# EAGLE design DoubleSwitch (EAGLE 6.6.0)
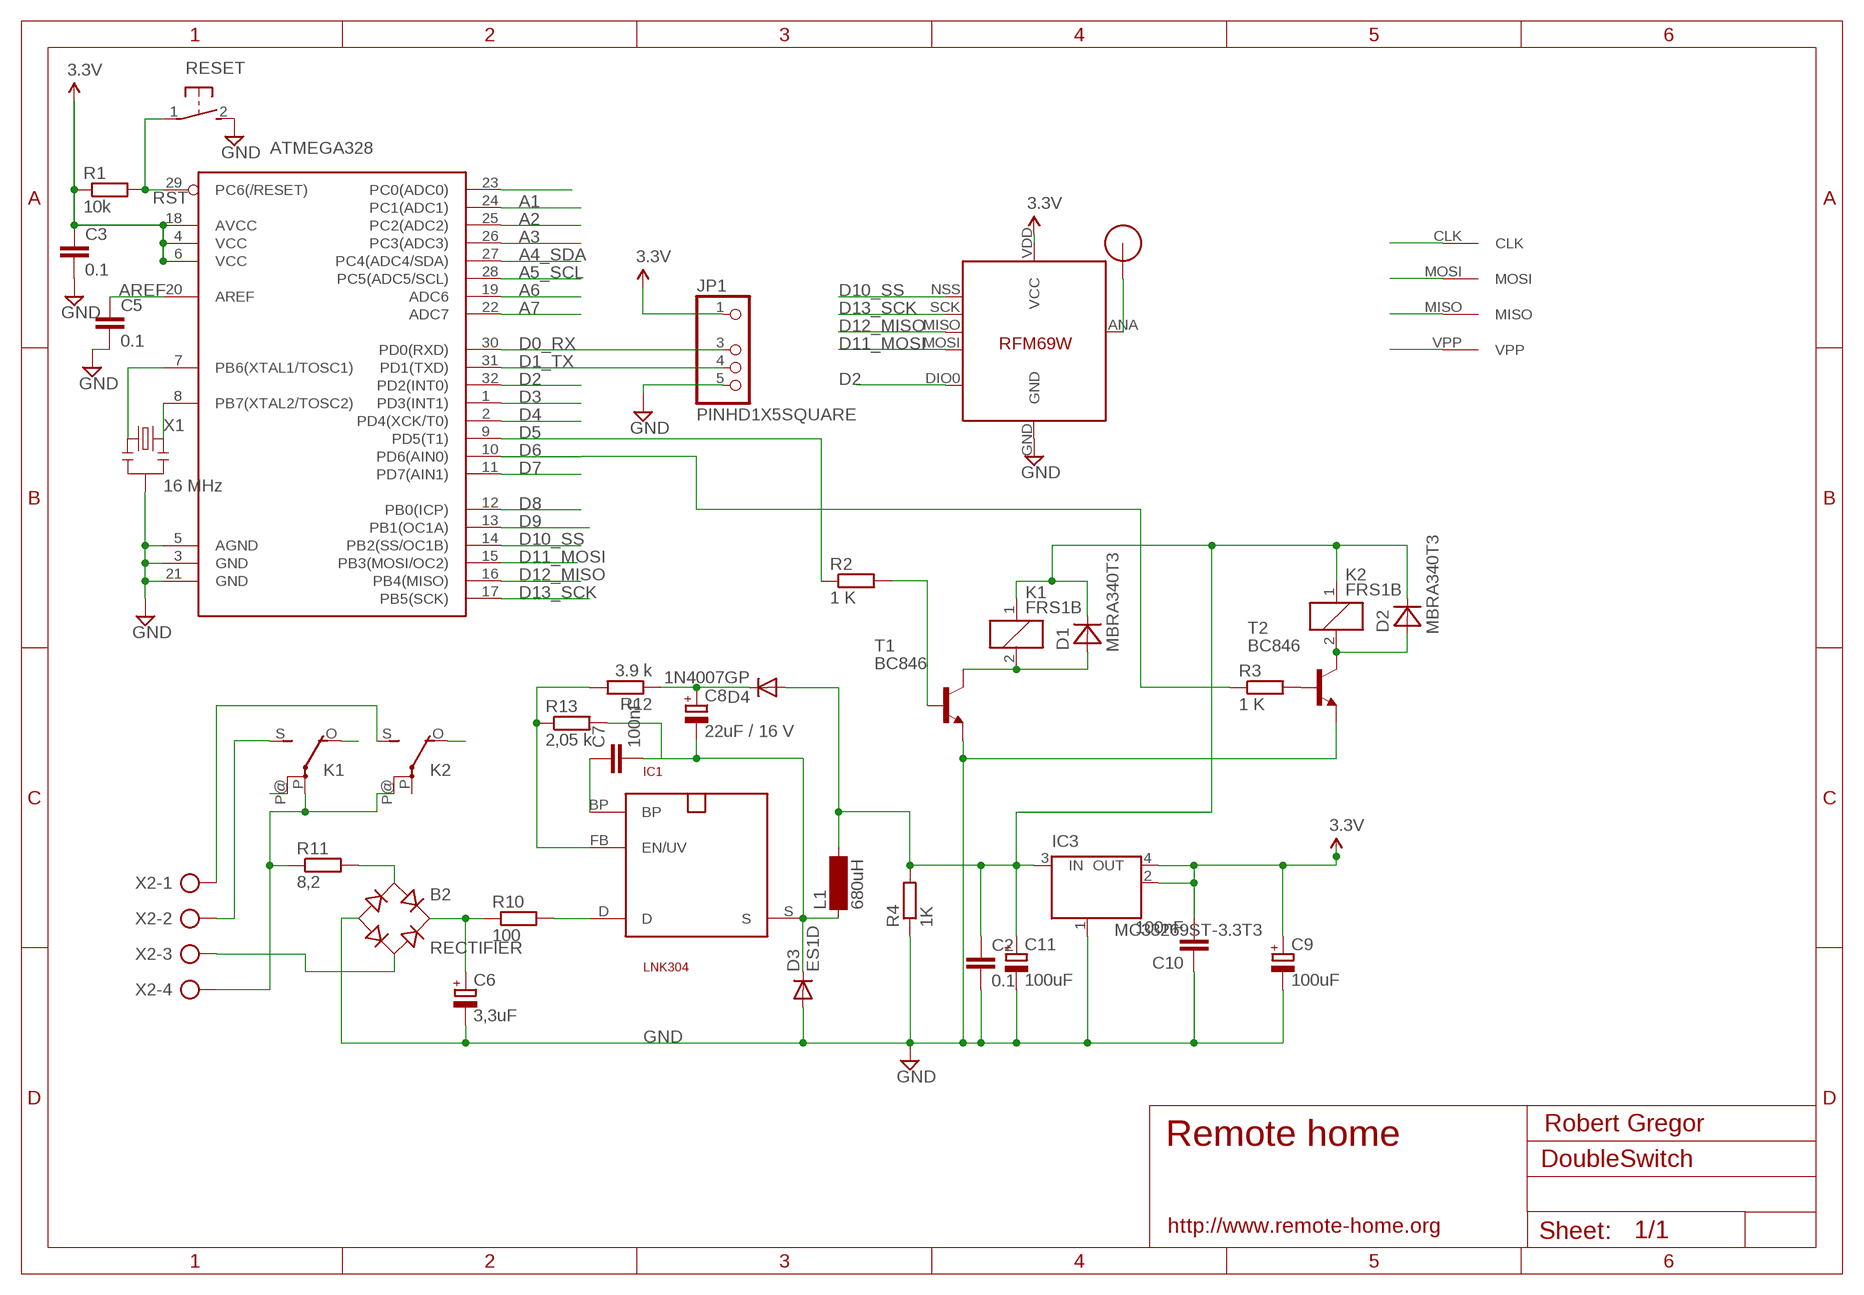
[diagram p0: schematic, sheet 1]

## Parts
ATMEGA328  ATMega-328  ATMEGA168/328TQFP32  [TQFP32-08]
B2  RECTIFIER  RECTIFIER-S40  [TO-269AA]
C2  0.1  C-EUC2012  [C2012]
C3  0.1  C-EUC2012  [C2012]
C5  0.1  C-EUC2012  [C2012]
C6  3,3uF  CPOL-EUE5-10.5  [E5-10,5]
C7  100nF  C-EUC2012  [C2012]
C8  22uF / 16 V  CPOL-EUSMCC  [SMC_C]
C9  100uF  CPOL-EUSMCB  [SMC_B]
C10  100nF  C-EUC2012  [C2012]
C11  100uF  CPOL-EUSMCB  [SMC_B]
D1  MBRA340T3  [SMA]
D2  MBRA340T3  [SMA]
D3  ES1D  DIODE-DO214AC  [DO214AC]
D4  1N4007GP  DIODE-DO214AA  [DO214AA]
IC1  LNK304  SO-8C  [SO-8C]
IC3  MC33269ST-3.3T3  [SOT223]
JP1  PINHD1X5SQUARE  [PINHD1X05-SQUARE]
K1  FRS1B  [FRS1B]
K2  FRS1B  [FRS1B]
L1  680uH  BS11  [BS11]
R1  10k  R-EU_M2012  [M2012]
R2  1 K  R-EU_M2012  [M2012]
R3  1 K  R-EU_M2012  [M2012]
R4  1K  R-EU_M2012  [M2012]
R10  100  R-EU_R2512W  [R2512W]
R11  8,2  R-EU_0411/12  [0411/12]
R12  3.9 k  R-EU_M2012  [M2012]
R13  2,05 k  R-EU_M2012  [M2012]
RESET  DTSM-3  [DTSM-3]
T1  BC846  [SOT23]
T2  BC846  [SOT23]
U$1  RFM12B_ANTENNA  [RFM12B-ANTENNA]
U$2  AVRHEADERDIP  [AVRHEADER]
U$5  RFM69  [RFM69W-MINPADS]
X1  16 MHz  RESONATORSMD  [RESONATOR-SMD]
X2  AK500/4  [AK500/4]

## Nets
5V: C2.1 C11.+ D1.C D2.C D4.A IC3.3(IN) K1.1 K2.1 L1.2 R4.2
A0: ATMEGA328.23(PC0(ADC0))
A1: ATMEGA328.24(PC1(ADC1))
A2: ATMEGA328.25(PC2(ADC2))
A3: ATMEGA328.26(PC3(ADC3))
A4_SDA: ATMEGA328.27(PC4(ADC4/SDA))
A5_SCL: ATMEGA328.28(PC5(ADC5/SCL))
A6: ATMEGA328.19(ADC6)
A7: ATMEGA328.22(ADC7)
AREF: ATMEGA328.20(AREF) C5.1
D0_RX: ATMEGA328.30(PD0(RXD)) JP1.3
D1_TX: ATMEGA328.31(PD1(TXD)) JP1.4
D2: ATMEGA328.32(PD2(INT0)) U$5.DIO0
D3: ATMEGA328.1(PD3(INT1))
D4: ATMEGA328.2(PD4(XCK/T0))
D5: ATMEGA328.9(PD5(T1)) R2.1
D6: ATMEGA328.10(PD6(AIN0)) R3.1
D7: ATMEGA328.11(PD7(AIN1))
D8: ATMEGA328.12(PB0(ICP))
D9: ATMEGA328.13(PB1(OC1A))
D10_SS: ATMEGA328.14(PB2(SS/OC1B)) U$5.NSS(SEL)
D11_MOSI: ATMEGA328.15(PB3(MOSI/OC2)) U$2.MOSI U$5.MOSI
D12_MISO: ATMEGA328.16(PB4(MISO)) U$2.MISO U$5.MISO
D13_SCK: ATMEGA328.17(PB5(SCK)) U$2.CLK U$5.SCK
GND [power]: ATMEGA328.3(GND) ATMEGA328.5(AGND) ATMEGA328.21(GND) B2.- C2.2 C3.2 C5.2 C6.- C9.- C10.1 C11.- D3.A IC3.1(GND/ADJ) JP1.5 R4.1 RESET.2 T1.2(E) T2.2(E) U$5.GND X1.2
N678: IC1.FB(EN/UV) R12.2 R13.1
N$1: ATMEGA328.7(PB6(XTAL1/TOSC1)) X1.1
N$2: R2.2 T1.1(B)
N$3: U$1.P$1 U$5.ANA(ANT)
N$4: D2.A K2.2 T2.3(C)
N$5: D1.A K1.2 T1.3(C)
N$6: R3.2 T2.1(B)
N$7 [220V]: K1.S(2:S) X2.2
N$9 [220V]: B2.AC2 X2.3
N$11 [220V]: K1.P@(2:P)
N$12 [220V]: K2.S(2:S) X2.1
N$13 [220V]: IC1.D R10.2
N$14 [220V]: B2.+ C6.+ R10.1
N$15 [220V]: B2.AC1 R11.2
N$16 [220V]: K1.P(2:P) K2.P@(2:P) R11.1 X2.4
N$17 [220V]: K1.O(2:O)
N$18: C7.1 IC1.BP
N$19 [220V]: K2.O(2:O)
N$20: C8.+ D4.C R12.1
N$21: ATMEGA328.8(PB7(XTAL2/TOSC2)) X1.3
RST: ATMEGA328.29(PC6(/RESET)) R1.2 RESET.1 U$2.VPP
S: C7.2 C8.- D3.C IC1.S L1.1 R13.2
VCC: ATMEGA328.4(VCC) ATMEGA328.6(VCC) ATMEGA328.18(AVCC) C3.1 C9.+ C10.2 IC3.2(OUT) IC3.4(OUT) JP1.1 R1.1 U$5.VDD(VCC) ; supply symbol labelled 3.3V
Unconnected: K2.P(2:P)

## Notes on the sheet
- Robert Gregor
- Remote home
- http://www.remote-home.org

## Library data of the parts
ATMEGA328 = LowPowerLab:ATMEGA168/328: Atmel 32-pin 8-bit micro, 16k flash.
B2 = rectifier:RECTIFIER-: Rectifier
C2 C3 C5 C7 C10 = resistor:C-EU: CAPACITOR, European symbol
C6 C8 C9 C11 = resistor:CPOL-EU: POLARIZED CAPACITOR, European symbol
D1 D2 = diode:MBRA340T3: Surface Mount Schottky Power Rectifier Source: http://www.onsemi.com/pub_link/Collateral/MBRA340T3-D.PDF
D3 D4 = diode:DIODE-: DIODE
IC1 = powerint:SO-8C: 700V MOSFET für Schaltnetz-Trafos. Pin 3 fehlt. SMD
IC3 = linear:MC33269ST*: Adjustable Output Low Dropout Voltage Regulator 800 mA Source: http://www.onsemi.com/pub/Collateral/MC33269-D.PDF
JP1 = eagle-library-edeca.net-v5:PINHD1X5
K1 K2 = relay:FRS1B: RELAY 1 x switch, same as V23101-D6-A201, Siemens; OC_FARNELL: unknown; OC_NEWARK: unknown
L1 = inductor-neosid:BS: INDUCTOR nominal inductance, magnetically screened; OC_FARNELL: unknown; OC_NEWARK: unknown
R1-R4 R10-R13 = resistor:R-EU_: RESISTOR, European symbol
RESET = switch-tact:DTSM-3
T1 T2 = transistor:BC846: NPN TRANSISTOR
U$1 = LowPowerLab:RFM12B_ANTENNA
U$2 = RemoteHome:AVRHEADER
U$5 = LowPowerLab:RFM69
X1 = SparkFun:RESONATOR: Resonator Small SMD resonator. This is the itty bitty 10/20MHz resonators with built in caps. CSTCE10M0G55 and CSTCE20M0V53. Footprint has been reviewed closely but hasn't been tested yet.
X2 = con-ptr500:AK500/4: CONNECTOR; OC_FARNELL: unknown; OC_NEWARK: unknown

## Net classes
1 power: width 0.381 mm, clearance 0.254 mm
2 220V: width 0.381 mm, clearance 0.508 mm

## Board
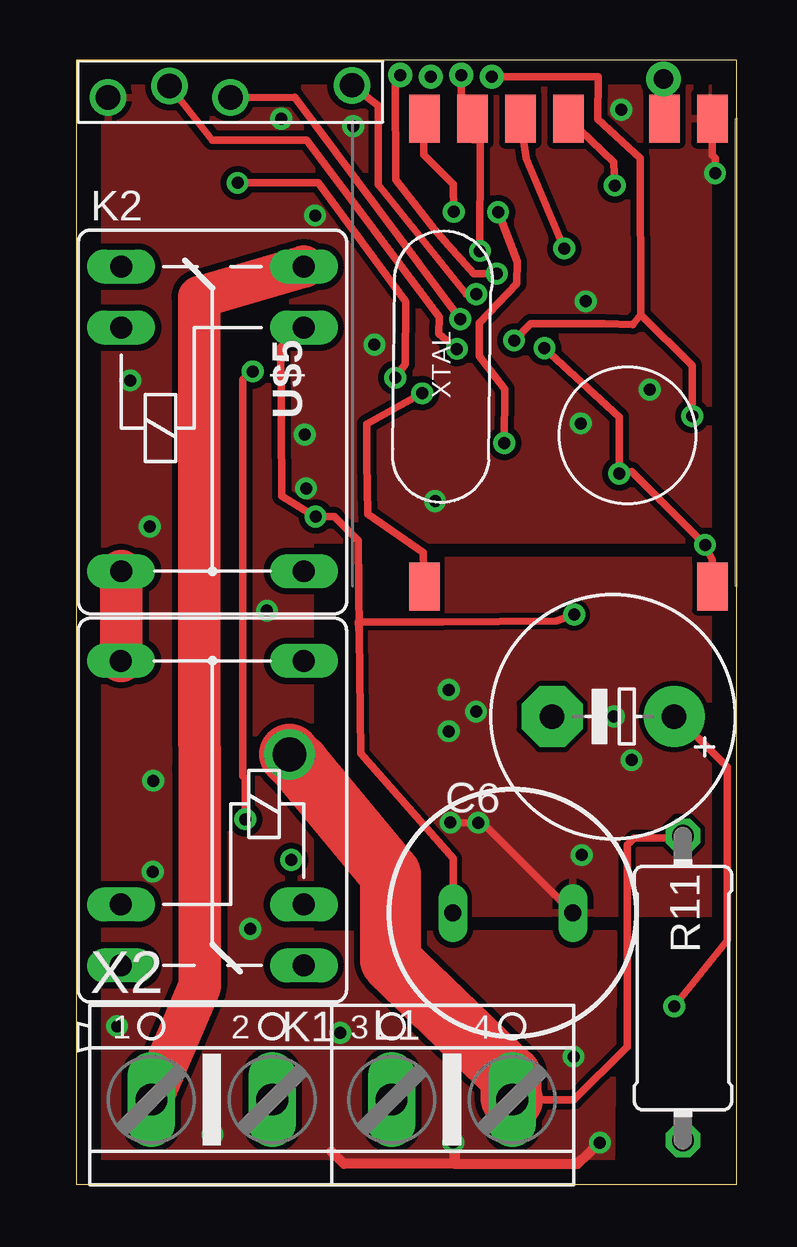
[diagram p1: board, top side]
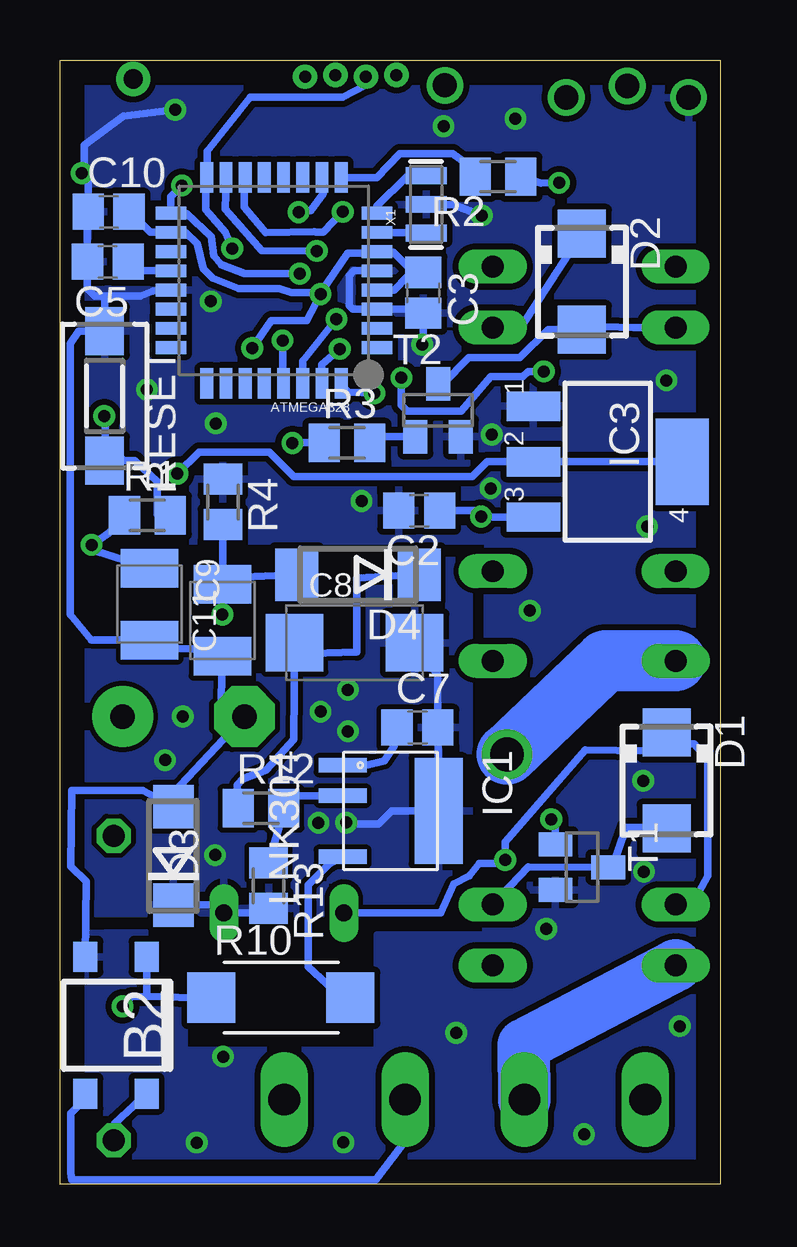
[diagram p2: board, bottom side, seen from below]

Size 27.51 x 46.86 mm. Coordinates in mm from the lower left corner, seen from the top.
Outline: 0.01,46.86 27.51,46.86 27.51,46.78 27.5,0 0,0 0,46.86
Copper layers (1*16): Top 0.035mm / dielectric 1.5mm / Bottom 0.035mm
Design rules "default": minimum track width 10mil, minimum drill 24mil, track to track 8mil, track to pad 8mil, pad to pad 8mil, via to via 8mil, smd to smd 8mil, copper to edge 40mil, drill to drill 8mil, minimum pad ring 10mil, minimum via ring 8mil, stop-mask expansion 4mil, vias tented up to drill 0mil, thermal gap 10mil

### Footprints (pad centres in the part's own frame; a part is rotated, then mirrored left to right if it is on the bottom)
TQFP32-08 = smd 1.27 x 0.533: 1 -4.293,2.8; 2 -4.293,2; 3 -4.293,1.2; 4 -4.293,0.4; 5 -4.293,-0.4; 6 -4.293,-1.2; 7 -4.293,-2; 8 -4.293,-2.8; 17 4.293,-2.8; 18 4.293,-2; 19 4.293,-1.2; 20 4.293,-0.4; 21 4.293,0.4; 22 4.293,1.2; 23 4.293,2; 24 4.293,2.8 | smd 0.533 x 1.27: 9 -2.8,-4.293; 10 -2,-4.293; 11 -1.2,-4.293; 12 -0.4,-4.293; 13 0.4,-4.293; 14 1.2,-4.293; 15 2,-4.293; 16 2.8,-4.293; 25 2.8,4.293; 26 2,4.293; 27 1.2,4.293; 28 0.4,4.293; 29 -0.4,4.293; 30 -1.2,4.293; 31 -2,4.293; 32 -2.8,4.293
TO-269AA = smd 1 x 1.25: + -1.28,-2.855; - 1.28,-2.855; AC1 -1.28,2.855; AC2 1.28,2.855
C2012 = smd 1.3 x 1.5: 1 -0.85,0; 2 0.85,0
E5-10,5 = drill 1.016 pad 2.54: + -2.54,0 | drill 1.016 pad 2.54 octagon: - 2.54,0
SMC_C = smd 2.4 x 2.4: + -2.5,0; - 2.5,0
SMC_B = smd 1.6 x 2.4: + -1.5,0; - 1.5,0
SMA = smd 2 x 2: A 2,0; C -2,0
DO214AC = smd 1.8 x 1.7: A 2.05,0; C -2.05,0
DO214AA = smd 1.8 x 2.2: A 2.55,0; C -2.55,0
SO-8C = smd 0.6 x 2: BP -1.905,-2; D 1.905,-2; FB -0.635,-2 | smd 4.41 x 2: S 0,2
SOT223 = smd 1.219 x 2.235: 1 -2.311,-3.099; 2 0,-3.099; 3 2.311,-3.099 | smd 3.6 x 2.2: 4 0,3.099
PINHD1X05-SQUARE = drill 1.016: 1 -5.061,-0.269; 3 0,0.24; 4 2.54,-0.24; 5 5.099,0.24
FRS1B = drill 0.914 long: 1 0,3.81; 2 0,-3.81; O -2.54,-3.81; P 10.16,3.81; P@ 10.16,-3.81; S -2.54,3.81
BS11 = drill 0.7 long: 1 -2.5,0; 2 2.5,0
M2012 = smd 1.3 x 1.6: 1 -0.95,0; 2 0.95,0
R2512W = smd 2 x 2.1: 1 -2.896,0; 2 2.896,0
0411/12 = drill 0.914 octagon: 1 -6.35,0; 2 6.35,0
DTSM-3 = smd 2 x 1.6: 1 -2.7,0; 2 2.7,0
SOT23 = smd 1 x 1.4: 1 -0.95,-1.1; 2 0.95,-1.1; 3 0,1.1
RFM12B-ANTENNA = drill 0.8 pad 1.422: P$1 0,0
AVRHEADER = drill 0.5: CLK 2.54,0; MISO 1.27,0.07; MOSI 0,0; VPP -1.27,0.072
RFM69W-MINPADS = smd 2 x 1.27: ANA 8,-5; DIO0 -11.5,5; GND 8,-7; MISO 8,1; MOSI 8,3; NSS 8,5; SCK 8,-1; VDD -11.5,-7
RESONATOR-SMD = smd 0.7 x 1.7: 1 -1.2,0; 2 0,0; 3 1.2,0
AK500/4 = drill 1.321 long: 1 -7.518,0; 2 -2.489,0; 3 2.489,0; 4 7.518,0

### Placement (x,y rotation side)
ATMEGA328  18.59,37.68 180 bottom
B2  25.17,6.63 180 bottom
C2  12.54,28.08 180 bottom
C3  12.37,37.16 270 bottom
C5  25.51,38.45 180 bottom
C6  22.36,19.5 180 top
C7  12.62,19.04 0 bottom
C8  15.23,22.57 0 bottom
C9  23.77,24.18 270 bottom
C10  25.48,40.53 0 bottom
C11  20.74,23.5 270 bottom
D1  2.24,16.83 270 bottom
D2  5.76,37.62 270 bottom
D3  22.78,13.69 90 bottom
D4  15.09,25.41 180 bottom
IC1  13.73,15.56 270 bottom
IC3  4.68,30.12 270 bottom
JP1  6.41,45.54 180 top
K1  5.66,11.66 90 top
K2  5.67,35.71 270 top
L1  18.18,11.31 180 top
R1  23.87,27.88 0 bottom
R2  9.26,42 0 bottom
R3  15.55,30.91 0 bottom
R4  20.72,28.44 270 bottom
R10  18.31,7.78 0 bottom
R11  25.27,8.18 270 top
R12  19.13,15.67 0 bottom
R13  18.82,12.44 270 bottom
RESET  25.65,32.86 90 bottom
T1  5.76,13.22 270 bottom
T2  11.75,32.26 0 bottom
U$1  24.46,46.07 0 top
U$2  16.03,46.24 180 top
U$5  19.49,36.42 90 top
X1  12.25,40.84 90 bottom
X2  10.64,3.53 0 top

### Tracks (layer width: path | path; a pad name or v marks a point on that pad's centre or on a via)
5V  (via drill 0.5)
  Top 0.305: 11.78,22.96 11.74,26.84 10.74,27.83 v9.96,27.83 9.7,27.98 8.56,28.69 8.5,34.9 K2.1 | 11.78,22.96 11.84,17.96 15.7,13.58 15.7,11.33 L1.2 | v20.74,23.75 20,23.49 15.26,23.44 11.75,23.44 11.78,22.96
  Bottom 0.305: D4.A 20.74,25.27 C11.+ 20.74,24.48 | K1.1 1.16,11.66 0.52,12.86 0.52,17.7 1.08,18.35 2.39,18.35 D1.C 3,18.07 5.63,18.11 8.95,14.27 v8.95,13.52 9.09,13.38 10.03,13.38 10.46,12.86 11.11,12.52 11.65,11.31 13.88,11.31 L1.2 | IC3.3 9.94,27.81 v9.96,27.83 10.21,28.08 C2.1 | 20.74,24.48 v20.74,23.75 | R4.2 20.73,24.68 20.74,24.48 | D2.C 8.3,35.72 K2.1
AREF
  Bottom 0.305: ATMEGA328.20 24.29,38.08 C5.1
D0_RX  (via drill 0.5)
  Top 0.305: JP1.3 9.1,45.31 v15.99,36.06
  Bottom 0.305: v15.99,36.06 17.39,34.3 ATMEGA328.30
D1_TX  (via drill 0.5)
  Top 0.305: JP1.4 5.66,43.52 9.6,43.52 15.11,36.15 15.09,35.46 v15.85,34.82
  Bottom 0.305: v15.85,34.82 16.61,34.17 ATMEGA328.31
D2  (via drill 0.5)
  Top 0.305: U$5.DIO0 14.45,26.34 12.13,27.93 12.1,30.15 12.09,30.82 12.09,31.69 v14.41,32.97
  Bottom 0.305: v14.41,32.97 15.49,33.01 ATMEGA328.32
D5
  Bottom 0.305: ATMEGA328.9 14.32,41.97 13.35,42.97 11.15,42.97 10.61,42.57 10.36,41.89 R2.1
D6  (via drill 0.5)
  Top 0.305: v17.82,30.89 17.84,33.15 16.77,34.52 16.77,35.9 18.34,37.55 18.37,38.45 v17.57,40.52
  Bottom 0.305: R3.1 17.93,30.91 v17.82,30.89 | v17.57,40.52 17.07,40.59 16.53,41.29 16.52,41.89 ATMEGA328.10
D9
  Bottom 0.305: 19.05,42.02 ATMEGA328.13
D10_SS  (via drill 0.5)
  Top 0.305: v15.72,40.53 15.7,41.68 14.47,42.91 14.47,44.4 U$5.NSS
  Bottom 0.305: ATMEGA328.14 19.8,41.98 19.82,40.72 18.94,39.67 16.91,39.71 16.85,39.7 16.54,39.7 v15.72,40.53
D11_MOSI  (via drill 0.5)
  Top 0.305: U$2.MOSI 16.03,44.88 U$5.MOSI 16.51,43.54 16.82,43.54 16.82,43.12 v16.81,38.91
  Bottom 0.305: v16.81,38.91 19.11,38.91 20.61,40.64 ATMEGA328.15
D12_MISO  (via drill 0.5)
  Top 0.305: U$5.MISO 18.74,42.75 v20.33,39.01
  Bottom 0.305: v20.33,39.01 20.63,39.68 21.43,40.63 21.43,41.93 ATMEGA328.16 21.37,41.99 21.37,43.05 19.59,45.31 15.72,45.31 14.76,45.81 U$2.MISO
D13_SCK  (via drill 0.5)
  Top 0.305: U$5.SCK 22.39,42.61 v22.43,41.63 | v17.51,37.96 16.54,37.96 15.5,39.14 14.91,39.82 13.3,41.87 13.28,45.91 U$2.CLK
  Bottom 0.305: v17.51,37.96 19.81,37.96 20.78,38.33 21.1,38.7 21.2,39.5 22.22,40.46 22.87,40.46 ATMEGA328.17 22.89,41.17 v22.43,41.63
GND  (via drill 0.5)
  Top 0.305: U$5.GND 26.49,42.89 26.61,42.78 v26.61,42.15
  Top 0.406: v15.69,1.74 15.76,0.85 20.88,0.85 v21.81,1.74 | 15.77,1.69 15.77,0.84 11.14,0.84 10.62,1.36
  Bottom 0.305: B2.- 26.42,12.62 27.05,13.26 27.02,16.41 24.07,16.41 D3.A 22.78,16.3 C6.- 20.78,20.23 C11.- 20.79,22.31 22.04,22.31 22.79,22.33 | 22.79,22.33 23.99,22.35 C9.- 26.21,22.69 27.08,23.74 27.08,35.03 26.73,35.56 RESET.2 25.65,36.94 25.55,37.03 | 22.87,22.4 22.79,22.33 | ATMEGA328.21 23.63,37.24 24.17,37.03 25.55,37.03 | 25.55,37.03 26.06,37.03 26.36,37.33 C5.2 26.36,40.5 C10.1 26.33,41.87 v26.61,42.15 26.49,42.26 26.49,43.31 24.87,44.53 v22.7,44.79 | ATMEGA328.5 15.27,38.08 15.46,37.88 15.46,36.63 15.3,36.47 ATMEGA328.3 12.53,36.48 C3.2 12.37,35.04 v12.41,35 | X1.2 11.12,40.84 v9.94,40.38
  other vias: 10.99,6.31 9.52,31.25 14.94,28.48 2.24,33.51 5.67,2.08 20.71,5.32 1.69,6.59 3.17,13.03 3.2,16.82 7.93,23.91 23.89,33.12 21.02,31.71 3.05,27.41 9.57,29.01 21.22,36.81 11.53,44.11 8.53,44.42 7.24,10.64
  pour Top: 0.17,46.7 27.34,46.7 27.37,28.95 27.34,27.61 27.34,26.85 9.73,26.85 9.73,10.73 9.73,10.41 22.39,10.45 22.28,0.15 0.15,0.15 0.15,46.62
  pour Bottom: 0.23,46.7 27.35,46.66 27.36,26.82 9.69,26.79 9.77,10.41 14.3,10.39 14.28,5.61 22.34,5.58 22.31,10.53 27.34,10.46 27.35,0.16 0.18,0.16 0.15,46.66
N678
  Bottom 0.305: R13.1 18.16,15.65 R12.2 17.67,16.19 15.69,16.19 15.7,16.2 IC1.FB
N$1
  Bottom 0.305: ATMEGA328.7 12.28,39.67 X1.1
N$2  (via drill 0.5)
  Top 0.305: v7.03,15.22 7.03,16.91 6.92,17.03 6.92,33.54 7.31,33.93 v7.35,33.88 | v6.71,41.74 10.07,41.75 13.72,36.8 13.69,34.18 v13.28,33.62
  Bottom 0.305: T1.1 6.86,15.04 v7.03,15.22 | v7.35,33.88 8,33.88 8.22,33.66 9.56,33.66 10.78,32.23 13.03,32.23 13.28,32.48 v13.28,33.62 | R2.2 7.47,41.72 v6.71,41.74
N$3
  Top 0.305: U$5.ANA 24.45,46.06 U$1.P$1
N$4
  Bottom 0.305: K2.2 3.61,35.71 5.48,35.77 5.55,34.99 D2.A 7.17,35.62 8.35,34.45 10.48,34.45 11.56,33.36 T2.3
N$5
  Bottom 0.305: D1.A 3.26,14.88 3.92,14.87 4.49,13.22 T1.3 7.99,13.22 K1.2
N$6
  Bottom 0.305: T2.1 14.6,31.16 R3.2
N$7
  Bottom 2.184: X2.2 8.19,5.82 K1.S
N$9
  Bottom 0.305: B2.AC2 26.42,3.63 27.05,2.96 27.05,0.49 27.02,0.2 14.36,0.2 13.22,1.66 13.22,3.44 X2.3
N$12
  Top 1.778: K2.S 5.11,36.98 5.12,31.41 5.12,19.18 5.13,17.33 5.13,8.25 X2.1
N$13
  Bottom 0.305: R10.2 15.42,7.78 15.5,7.85 15.85,7.85 17.17,9.05 17.17,12.47 16.32,13.34 15.74,13.65 IC1.D
N$14  (via drill 0.5)
  Top 0.305: v24.9,7.42 27.12,10.16 27.12,17.39 25.25,19.26 C6.+
  Bottom 0.305: R10.1 21.9,7.78 23.89,7.84 | v24.9,7.42 24.54,7.8 23.89,7.84 | B2.+ 23.89,7.84
N$15
  Bottom 0.305: R11.2 25.27,1.74 25.23,1.69 25.23,2.54 B2.AC1
N$16  (via drill 1.4)
  Top 0.305: R11.1 25.17,14.43 23.24,14.43 22.95,14.14 22.95,5.73 20.73,3.51 X2.4
  Top 1.778: K2.P@ K1.P
  Top 2.54: v8.87,17.92 9.28,17.5 13.08,12.91 13.08,9.33 18.09,4.51 18.09,3.59 X2.4
  Bottom 2.54: K1.P 4.79,21.82 v8.87,17.92
N$18
  Bottom 0.305: C7.1 13.58,18.27 13.99,17.65 14.84,17.44 IC1.BP
N$20
  Bottom 0.305: R12.1 20.12,16.64 19.89,16.9 18.91,17.26 17.77,18.54 C8.+ 17.64,22.11 15.14,22.18 15.14,25.27 D4.C
N$21
  Bottom 0.305: ATMEGA328.8 14.3,40.77 13.07,42 12.29,42 X1.3
RST  (via drill 0.5)
  Top 0.305: v18.23,35.17 18.93,35.87 21.98,35.87 23.17,35.84 23.52,36.26 | U$2.VPP 21.74,46.16 21.72,44.4 23.48,42.77 23.52,36.26 | v25.66,32.02 25.66,34.12 23.52,36.26
  Bottom 0.305: v18.23,35.17 18.23,33.42 ATMEGA328.29 | RESET.1 24.39,30.16 | 24.39,30.16 23.45,29.3 23.45,27.91 R1.2 | 24.39,30.16 24.86,30.16 25.62,30.93 25.62,31.98 v25.66,32.02
S  (via drill 0.5)
  Top 0.305: v15.58,15.08 16.94,15.05 L1.1
  Bottom 0.305: D3.C 21.01,11.64 L1.1 18.3,11.31 R13.2 | C8.- 11.77,21.23 C7.2 11.75,19.02 IC1.S 11.72,15.55 13.69,15.55 14.23,15.02 15.72,15.02 v15.58,15.08
  other vias: 15.51,20.61 15.51,18.88 16.74,15.07 16.65,19.7 22.4,19.5 21.05,13.72 23.13,17.68
  pour Bottom: 27.39,21.97 27.36,26 10.46,26 10.46,11.28 27.34,11.28 27.36,22.02
  pour Top: 27.36,19.49 27.36,26 10.51,26 10.51,11.28 27.36,11.28
VCC  (via drill 0.5)
  Top 0.305: U$5.VDD 26.48,26.03 v26.19,26.66 23.13,29.72 v22.61,29.63 22.61,31.98 v19.5,34.85 | JP1.1 12.56,44.97 12.58,41.66 16.25,37.1 v16.65,37.1
  Bottom 0.305: IC3.4 IC3.2 9.71,30.12 10.33,29.5 17.77,29.5 18.8,30.53 21.71,30.53 v22.61,29.63 | C9.+ 25.95,26.36 v26.19,26.66 25.48,27.15 R1.1 | C10.2 24.59,40.53 23.74,39.68 ATMEGA328.18 22.27,39.67 21.78,39.22 21.54,38.17 21.15,37.77 20.05,37.33 18.36,37.34 17.85,37.17 16.64,37.17 | ATMEGA328.4 13.58,37.27 13.03,37.83 12.55,37.83 C3.1 12.78,38.01 13.61,38.84 14.27,38.84 ATMEGA328.6 14.36,38.82 15.53,38.82 16.64,37.17 | 16.64,37.17 v16.65,37.1 17.22,36 18.71,36 v19.5,34.85